# Altium schematic sheet SMPS_5V_.SchDoc
size B
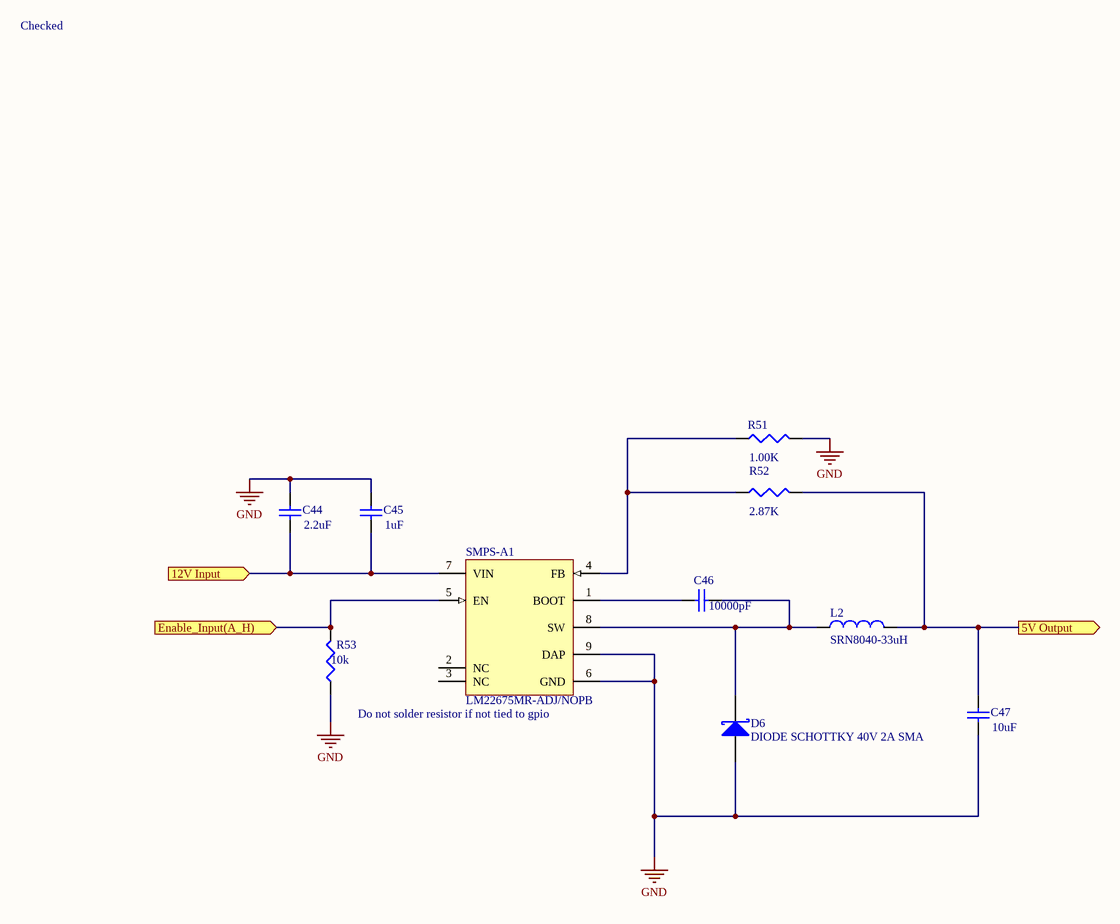
[diagram p0: SMPS_5V_.SchDoc]

## Parts
C44  value 2.2uF  [C1210]  (hidden comment: Cap-100V)
C45  value 1uF  [CAPC2012X09M]  (hidden comment: Cap)
C46  value 10000pF  [CAPC2012X09M]  (hidden comment: Cap)
C47  value 10uF  [C1210]  (hidden comment: Cap-10v-A)
D6  DIODE SCHOTTKY 40V 2A SMA  [DIOM4326X23M]
L2  SRN8040-33uH  [INDP8080X40M]
R51  value 1.00K  [RESC2112X05M]  (hidden comment: RFb1)
R52  value 2.87K  [RESC2112X05M]  (hidden comment: Res3)
R53  value 10k  [RESC2112X05M]  (hidden comment: Res3)
SMPS-A1  LM22675MR-ADJ/NOPB  [MRA08B_L]

## Ports
5V Output (out), 12V Input (in), Enable_Input(A_H) (in)

## Nets
GND: C44.2 C45.2 C47.1 D6.2(A) R51.2 R53.1 SMPS-A1.6(GND) SMPS-A1.9(DAP)
5V Output: C47.2 L2.2 R52.2 ; port 5V Output
12V Input: C44.1 C45.1 SMPS-A1.7(VIN) ; port 12V Input
Enable_Input(A_H): R53.2 SMPS-A1.5(EN) ; port Enable_Input(A_H)
NetC46_1: C46.1 D6.1(K) L2.1 SMPS-A1.8(SW)
NetC46_2: C46.2 SMPS-A1.1(BOOT)
NetR51_1: R51.1 R52.1 SMPS-A1.4(FB)

Not connected (* = marked no-connect by the designer): SMPS-A1 2(NC) 3(NC)

## Notes on the sheet
- Checked
- Do not solder resistor if not tied to gpio
- ESE
- is the sole property of ESE. Any reproduction
- The Information Contained in this drawing
- Schematic P/N and Name
- Sheet Name
- 299 Doon Valley Drive
- Kitchener, ON N2G 4M4
- Canada
- Approved
- in part or in whole without the written
- permission of ESE is strictly prohibited.
- APPROVALS
- DATE
- Size
- Scale
- B
- NTS
- Bare PCB P/N
- Date
- Sheet
- Rev.
- Engineer
- of

## Library data of the parts
C44 C47 = Cap: Capacitor; Published: 8-Jun-2000; LatestRevisionDate: 17-Jul-2002; LatestRevisionNote: Re-released for DXP Platform.; PackageReference: RAD-0.3; Publisher: Altium Limited; PackageDescription: Radial Cap, Thru-Hole; 2 Leads; 0.3 in Pin Spacing
  C44: URL: http://www.digikey.ca/product-detail/en/HMK325B7225KN-T/587-1778-2-ND/1212778
C45 = CAP-X7R-1uF-16V-±10%: CAP CER 1uF 16v X7R 0805; MPN: C0805C105K4RACTU; WV: 16; Tolerance: ±10%; PN: 399-1284-1-ND; Name: CAP-X7R-1uF-16V-±10%; Type: X7R; URL: http://www.digikey.ca/product-detail/en/C0805C105K4RACTU/399-1284-1-ND
C46 = CAP-X7R-10000pF-100V-±10%: CAP CER 10000pF 100v X7R 0805; MPN: C0805C103K1RACTU; WV: 100; Tolerance: ±10%; PN: 399-1159-1-ND; Name: CAP-X7R-10000pF-100V-±10%; Type: X7R; URL: http://www.digikey.ca/product-detail/en/C0805C103K1RACTU/399-1159-1-ND
D6 = DIODE SCHOTTKY 40V 2A SMA: Schottky Rectifier; MPN: B240A-13-F; PN: B240A-FDICT-ND; URL: http://www.digikey.ca/product-detail/en/B240A-13-F/B240A-FDICT-ND
L2 = SRN8040: FIXED IND 22UH 2.2A 100 MOHM SMD; MPN: SRN8040-220M; PN: SRN8040-220MCT-ND; URL: http://www.digikey.ca/product-detail/en/SRN8040-330M/SRN8040-330MCT-ND/2756183
R51 = Resistor_1.00K: RES SMD 1.00K OHM 1% 1/8W 0805; MPN: CRCW08051K00FKEA; PN: 541-1000KCCT-ND; Name: Resistor_1.00K; URL: http://www.digikey.ca/product-detail/en/CRCW08051K00FKEA/541-1000KCCT-ND
R52 R53 = Resistor_2.87K: RES SMD 2.87K OHM 1% 1/8W 0805; MPN: CRCW08052K87FKEA; PN: 541-2870KCCT-ND; Name: Resistor_2.87K; URL: http://www.digikey.ca/product-detail/en/CRCW08052K87FKEA/541-2870KCCT-ND
SMPS-A1 = LM22675MR-ADJ/NOPB: 1A SIMPLE SWITCHER®, Step-Down Voltage Regulator with Precision Enable, 8-pin PSOP, Pb-Free; Manufacturer: National Semiconductor; MPN: LM22675MRE-ADJ/NOPB; PackageTopMarking: NSXYTT*L22675*ADJ; PowerWise: N; High-Reliability: Y; PN: LM22675MRE-ADJ/NOPBCT-ND; DatasheetVersion: Dec-2010; PackageVersion: revB, Dec-2007; PackageReference: MRA08B; PackageDescription: Molded, PSOP .193 x .154 x .058in, 8 Lead, .050in Pitch, Large DAP; PartNumber: LM22675MR-ADJ/NOPB; RoHS: Y; PinCount: 8; CompType: Switcher; Code_JEDEC: MS-012-AA; ComponentLink1Description: Manufacturer URL; ComponentLink1URL: http://www.national.com/; ComponentLink2Description: LM22675 Datasheet; ComponentLink2URL: http://www.national.com/ds/LM/LM22675.pdf; ComponentLink3Description: LM22675 Web Page; ComponentLink3URL: http://www.national.com/pf/LM/LM22675.html; ComponentLink4Description: MRA08B Package Page; ComponentLink4URL: http://www.national.com/packaging/folders/mra08b.html; URL: http://www.digikey.ca/product-detail/en/LM22675MRE-ADJ%2FNOPB/LM22675MRE-ADJ%2FNOPBCT-ND